# EAGLE design Stalker v2.3 (EAGLE 6.1)
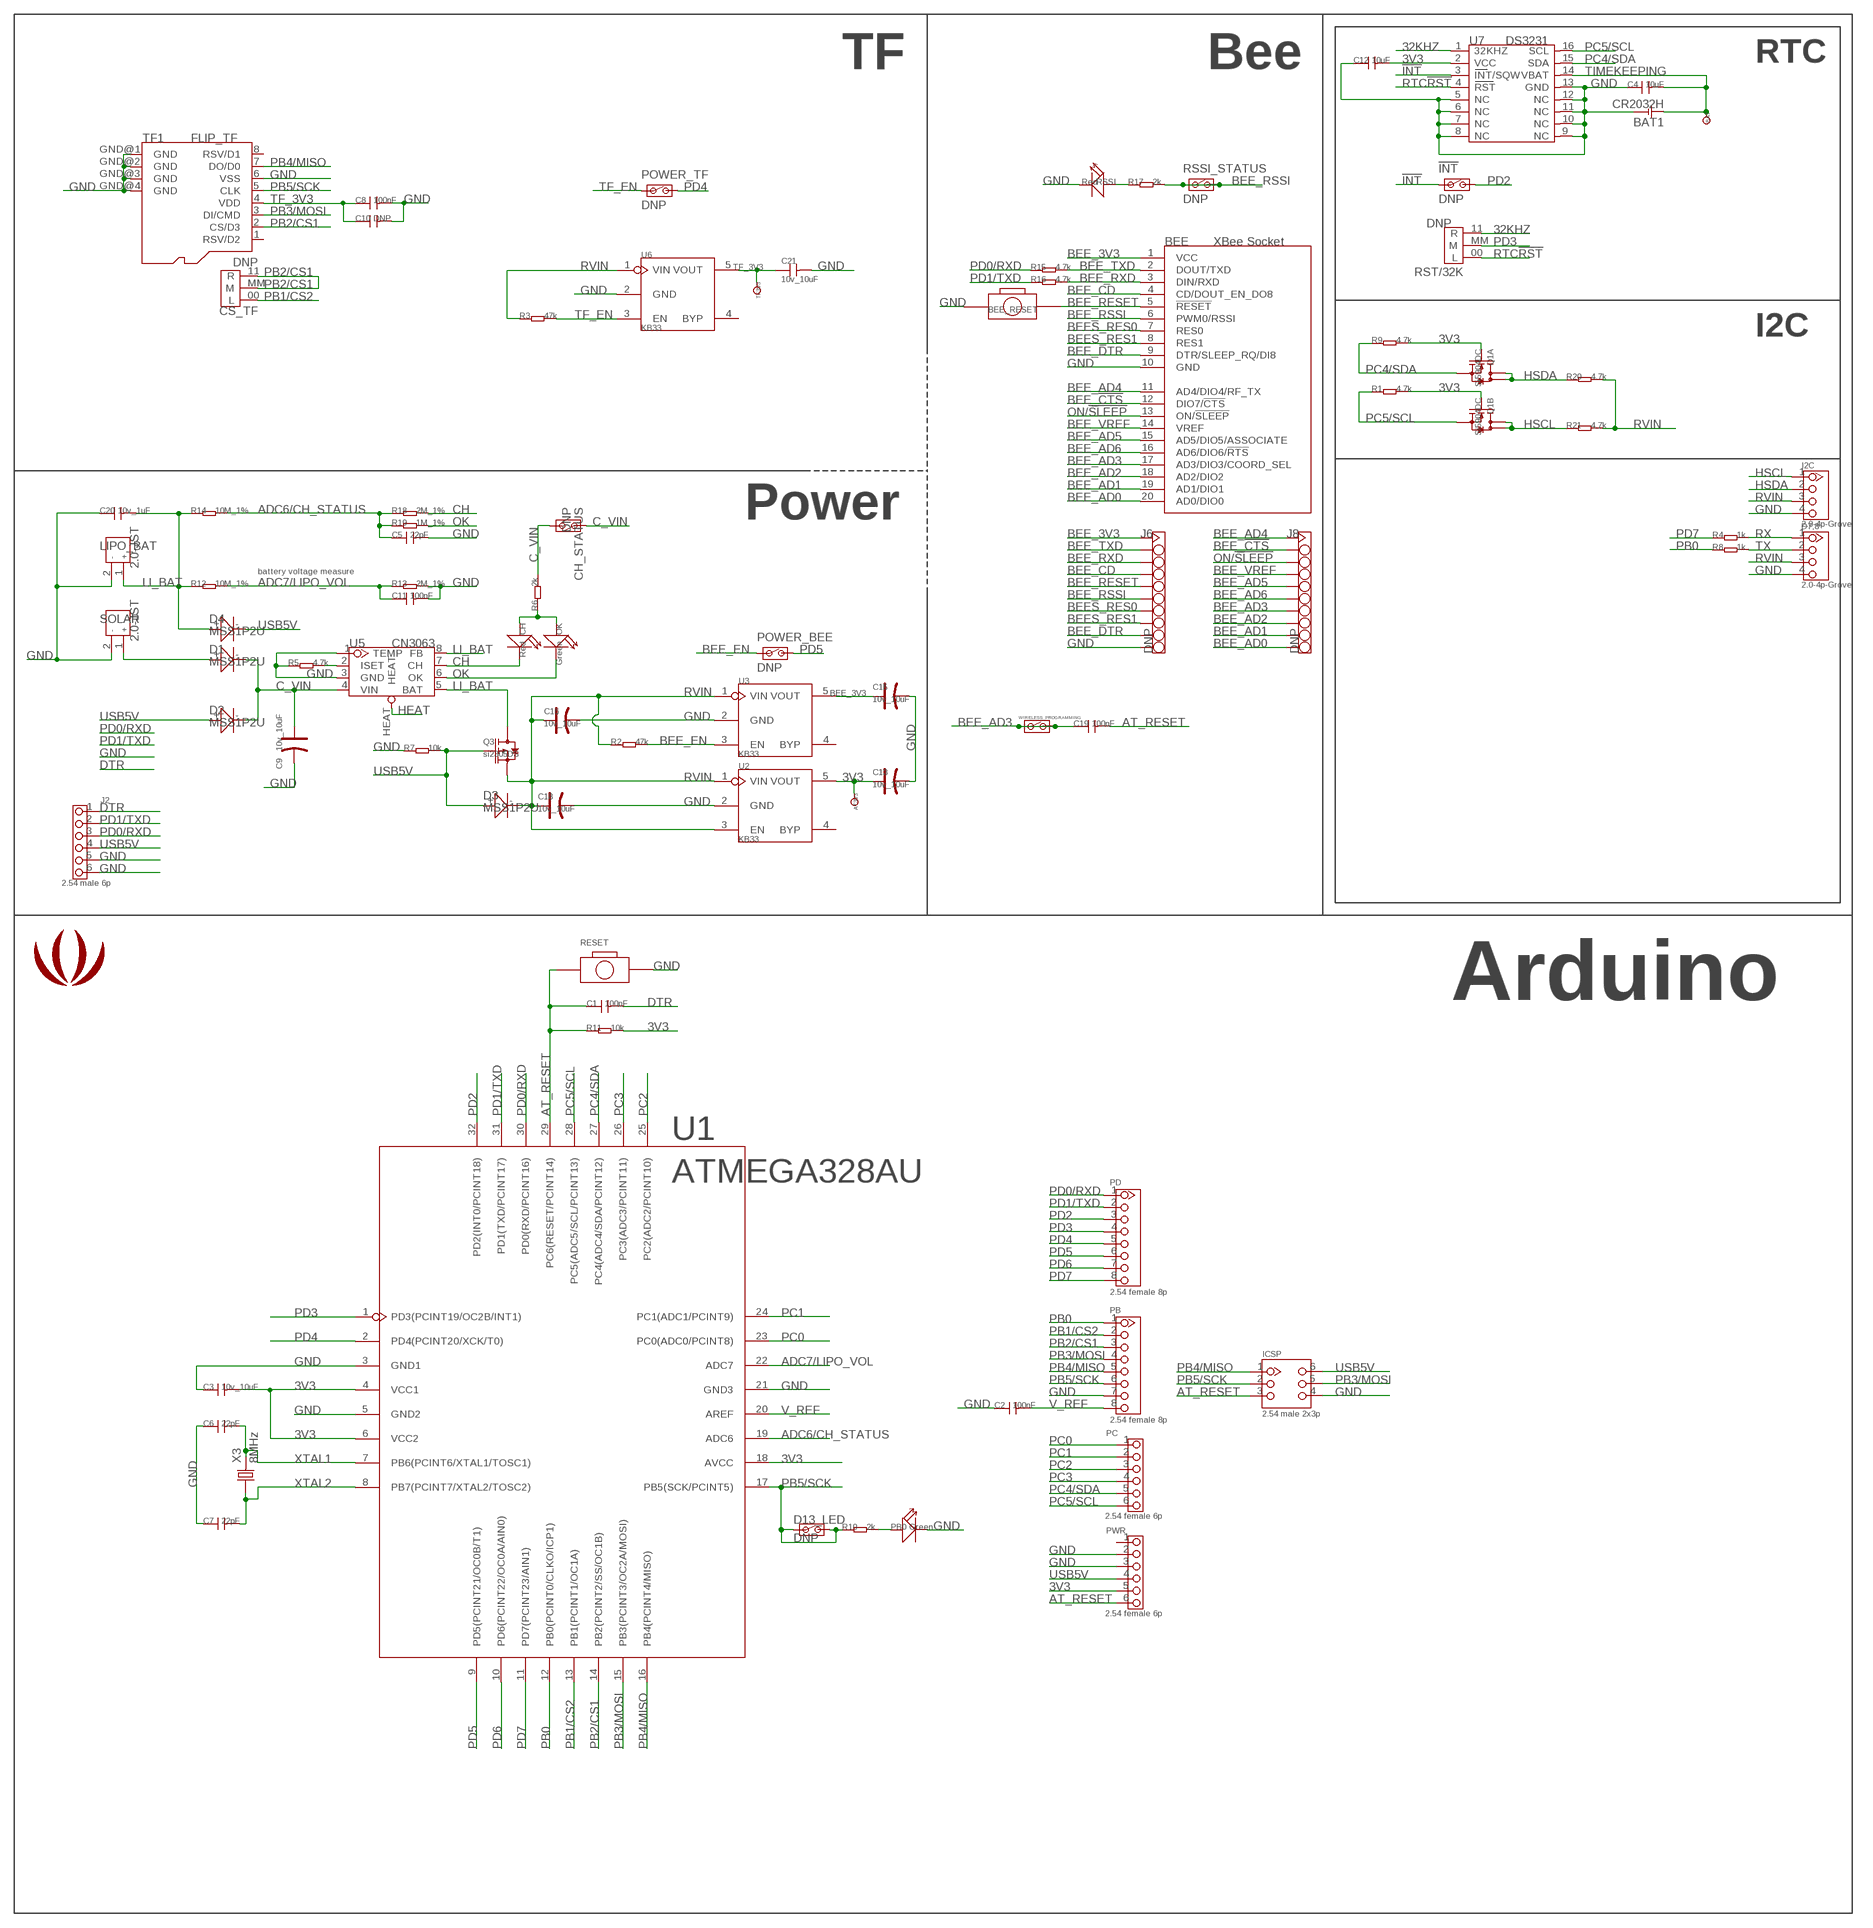
[diagram p0: schematic, sheet 1]

## Parts
!INT  DNP  JP_SW  [JP_SW]
AT3V3  DNP  TEST_POINT_SIZE_3030  [TP_3535]
BAT  DNP  TEST_POINT_SIZE_3030  [TP_3535]
BAT1  CR2032H  [CR2032H]
BEE  XBee Socket  BEEO  [BEE]
BEE_RESET  3.8x6.1 button  BOTTON_1_SMD  [BOTTON_1]
C1  100nF  C-0603  [0603]
C2  100nF  C-0603  [0603]
C3  10v_10uF  C-0805  [0805]
C4  10uF  C-0805  [0805]
C5  22pF  C-0603  [0603]
C6  22pF  C-0603  [0603]
C7  22pF  C-0603  [0603]
C8  100nF  C-0603  [0603]
C9  10v_10uF  CAP-AVX-A  [AVX-A]
C10  DNP  C-0603  [0603]
C11  100nF  C-0603  [0603]
C12  10uF  C-0805  [0805]
C13  10v_10uF  CAP-AVX-A  [AVX-A]
C15  10v_10uF  CAP-AVX-A  [AVX-A]
C16  10v_10uF  CAP-AVX-A  [AVX-A]
C18  10v_10uF  CAP-AVX-A  [AVX-A]
C19  100nF  C-0603  [0603]
C20  10v_1uF  C-0805  [0805]
C21  10v_10uF  C-0805  [0805]
CH  Red  007-LED0603  [D0603]
CH_STATUS  DNP  JP_SW  [JP_SW]
CS_TF  DNP  JUMPER  [JUMPER]
D1  MSS1P2U  010-DMSS1P2U  [D1005]
D2  MSS1P2U  010-DMSS1P2U  [D1005]
D3  MSS1P2U  010-DMSS1P2U  [D1005]
D4  MSS1P2U  010-DMSS1P2U  [D1005]
D7,8  2.0-4p-Grove  TWIG-4P-2.0-2.0  [4P-2.0]
D13_LED  DNP  JP_SW  [JP_SW]
I2C  2.0-4p-Grove  TWIG-4P-2.0-2.0  [4P-2.0]
ICSP  2.54 male 2x3p  HEADER-2X3P-2.54  [2X3P-2.54-LEADED]
J2  2.54 male 6p  HEADER-6P-LEADED-2.54  [6P-2.54-LEADED]
J6  DNP  HEADER_1X10DD  [HEADER_1X10]
J8  DNP  HEADER_1X10DD  [HEADER_1X10]
LIPO_BAT  2.0-JST  JACK-JST-2P-PW'2.0'  [JST-2.0]
LOGO1  LOGO  [LOGO_RO]
OK  Green  007-LED0603  [D0603]
PB  2.54 female 8p  HEADER-8P-2.54-LEADED  [8P-2.54-LEADED]
PB0  Green  007-LED0603  [D0603]
PC  2.54 female 6p  HEADER-6P-LEADED-2.54  [6P-2.54-LEADED]
PD  2.54 female 8p  HEADER-8P-2.54-LEADED  [8P-2.54-LEADED]
POWER_BEE  DNP  JP_SW  [JP_SW]
POWER_TF  DNP  JP_SW  [JP_SW]
PWR  2.54 female 6p  HEADER-6P-LEADED-2.54  [6P-2.54-LEADED]
Q1  Si5904DC  010-DUAL-N-MOSFET_1206-8  [1206-8]
Q3  si2305DS  010-P-MOSFETSOT23  [SOT23]
R1  4.7k  005-R0603  [0603@1]
R2  47k  005-R0603  [0603@1]
R3  47k  005-R0603  [0603@1]
R4  1k  005-R0603  [0603@1]
R5  4.7k  005-R0603  [0603@1]
R6  2k  005-R0603  [0603@1]
R7  10k  005-R0603  [0603@1]
R8  1k  005-R0603  [0603@1]
R9  4.7k  005-R0603  [0603@1]
R10  2k  005-R0603  [0603@1]
R11  10k  005-R0603  [0603@1]
R12  10M_1%  005-R0603  [0603@1]
R13  2M_1%  005-R0603  [0603@1]
R14  10M_1%  005-R0603  [0603@1]
R15  4.7k  005-R0603  [0603@1]
R16  4.7k  005-R0603  [0603@1]
R17  2k  005-R0603  [0603@1]
R18  2M_1%  005-R0603  [0603@1]
R19  1M_1%  005-R0603  [0603@1]
R20  4.7k  005-R0603  [0603@1]
R21  4.7k  005-R0603  [0603@1]
RESET  3.8x6.1 button  BOTTON_1_SMD  [BOTTON_1]
RSSI  Red  007-LED0603  [D0603]
RSSI_STATUS  DNP  JP_SW  [JP_SW]
RST/32K  DNP  JUMPER  [JUMPER]
SOLAR  2.0-JST  JACK-JST-2P-PW'2.0'  [JST-2.0]
TF1  FLIP_TF  [FLIP_TF]
TF3V3  DNP  TEST_POINT_SIZE_3030  [TP_3535]
U1  ATMEGA328AU  ATMEGA168-20AU  [ATMEGA168-20AU]
U2  KB33  MIC5025_X.X  [SOT23-5]
U3  KB33  MIC5025_X.X  [SOT23-5]
U5  CN3063  CN3083  [SOP8]
U6  KB33  MIC5025_X.X  [SOT23-5]
U7  DS3231  [SO16-W]
WIRELESS_PROGRAMMING  DNP  JP_SW  [JP_SW]
X3  8MHz  011-CRYSTALHC49S  [HC49/S]

## Nets
3V3: AT3V3.T C3.2 C12.2 C13.+ PWR.5 Q1.2(A:G) Q1.4(B:G) R1.2 R9.2 R11.2 U1.4(VCC1) U1.6(VCC2) U1.18(AVCC) U2.5(VOUT) U7.2(VCC)
32KHZ: RST/32K.11(R) U7.1(32KHZ)
!INT: !INT.1 U7.3(INT/SQW)
ADC6/CH_STATUS: C5.1 R14.2 R18.1 R19.1 U1.19(ADC6)
ADC7/LIPO_VOL: C11.1 R12.2 R13.1 U1.22(ADC7)
AT_RESET: C1.1 C19.2 ICSP.3 PWR.6 R11.1 RESET.1 U1.29(PC6(RESET/PCINT14))
BEE_3V3: BEE.1(VCC) C15.+ J6.1 U3.5(VOUT)
BEE_!CTS: BEE.12(DIO7/!CTS) J8.2
BEE_AD0: BEE.20(AD0/DIO0) J8.10
BEE_AD1: BEE.19(AD1/DIO1) J8.9
BEE_AD2: BEE.18(AD2/DIO2) J8.8
BEE_AD3: BEE.17(AD3/DIO3/COORD_SEL) C19.1 J8.7 WIRELESS_PROGRAMMING.1 WIRELESS_PROGRAMMING.2
BEE_AD4: BEE.11(AD4/DIO4/RF_TX) J8.1
BEE_AD5: BEE.15(AD5/DIO5/ASSOCIATE) J8.5
BEE_AD6: BEE.16(AD6/DIO6/!RTS) J8.6
BEE_CD: BEE.4(CD/DOUT_EN_DO8) J6.4
BEE_DTR: BEE.9(DTR/SLEEP_RQ/DI8) J6.9
BEE_EN: POWER_BEE.1 R2.2 U3.3(EN)
BEE_RESET: BEE.5(!RESET) BEE_RESET.P$2 J6.5
BEE_RSSI: BEE.6(PWM0/RSSI) J6.6 R17.2 RSSI_STATUS.1 RSSI_STATUS.2
BEE_RXD: BEE.3(DIN/RXD) J6.3 R16.2
BEE_TXD: BEE.2(DOUT/TXD) J6.2 R15.2
BEE_VREF: BEE.14(VREF) J8.4
BEES_RES0: BEE.7(RES0) J6.7
BEES_RES1: BEE.8(RES1) J6.8
C_VIN: C9.+ CH_STATUS.1 CH_STATUS.2 D1.- D2.- R6.2 U5.4(VIN)
CH: CH.- R18.2 U5.7(CH)
DTR: C1.2 J2.1
GND: BAT1.- BEE.10(GND) BEE_RESET.1 C2.1 C3.1 C4.1 C5.2 C6.1 C7.1 C8.2 C9.- C10.2 C11.2 C12.1 C13.- C15.- C16.- C18.- C20.1 C21.2 D7,8.4 I2C.4 ICSP.4 J2.5 J2.6 J6.10 LIPO_BAT.2 PB0.- PB.7 PWR.2 PWR.3 R5.1 R7.1 R13.2 RESET.P$2 RSSI.- SOLAR.2 TF1.6(VSS) TF1.GND@1(GND) TF1.GND@2(GND) TF1.GND@3(GND) TF1.GND@4(GND) U1.3(GND1) U1.5(GND2) U1.21(GND3) U2.2(GND) U3.2(GND) U5.1(TEMP) U5.3(GND) U6.2(GND) U7.5(NC) U7.6(NC) U7.7(NC) U7.8(NC) U7.9(NC) U7.10(NC) U7.11(NC) U7.12(NC) U7.13(GND)
HEAT: U5.HEAT
HSCL: I2C.1 Q1.5(B:D) Q1.6(B:D) R21.1
HSDA: I2C.2 Q1.7(A:D) Q1.8(A:D) R20.1
LI_BAT: C20.2 D4.+ LIPO_BAT.1 Q3.3(D) R12.1 R14.1 U5.5(BAT) U5.8(FB)
N$1: PB0.+ R10.2
N$3: D1.+ SOLAR.1
N$5: R5.2 U5.2(ISET)
N$6: R17.1 RSSI.+
N$8: CH.+ OK.+ R6.1
OK: OK.- R19.2 U5.6(OK)
ON/!SLEEP: BEE.13(ON/!SLEEP) J8.3
PB0: PB.1 R8.1 U1.12(PB0(PCINT0/CLKO/ICP1))
PB1/CS2: CS_TF.00(L) PB.2 U1.13(PB1(PCINT1/OC1A))
PB2/CS1: CS_TF.11(R) CS_TF.MM(M) PB.3 TF1.2(CS/D3) U1.14(PB2(PCINT2/SS/OC1B))
PB3/MOSI: ICSP.5 PB.4 TF1.3(DI/CMD) U1.15(PB3(PCINT3/OC2A/MOSI))
PB4/MISO: ICSP.1 PB.5 TF1.7(DO/D0) U1.16(PB4(PCINT4/MISO))
PB5/SCK: D13_LED.1 D13_LED.2 ICSP.2 PB.6 R10.1 TF1.5(CLK) U1.17(PB5(SCK/PCINT5))
PC0: PC.1 U1.23(PC0(ADC0/PCINT8))
PC1: PC.2 U1.24(PC1(ADC1/PCINT9))
PC2: PC.3 U1.25(PC2(ADC2/PCINT10))
PC3: PC.4 U1.26(PC3(ADC3/PCINT11))
PC4/SDA: PC.5 Q1.1(A:S) R9.1 U1.27(PC4(ADC4/SDA/PCINT12)) U7.15(SDA)
PC5/SCL: PC.6 Q1.3(B:S) R1.1 U1.28(PC5(ADC5/SCL/PCINT13)) U7.16(SCL)
PD0/RXD: J2.3 PD.1 R15.1 U1.30(PD0(RXD/PCINT16))
PD1/TXD: J2.2 PD.2 R16.1 U1.31(PD1(TXD/PCINT17))
PD2: !INT.2 PD.3 U1.32(PD2(INT0/PCINT18))
PD3: PD.4 RST/32K.MM(M) U1.1(PD3(PCINT19/OC2B/INT1))
PD4: PD.5 POWER_TF.2 U1.2(PD4(PCINT20/XCK/T0))
PD5: PD.6 POWER_BEE.2 U1.9(PD5(PCINT21/OC0B/T1))
PD6: PD.7 U1.10(PD6(PCINT22/OC0A/AIN0))
PD7: PD.8 R4.1 U1.11(PD7(PCINT23/AIN1))
RTC!RST: RST/32K.00(L) U7.4(RST)
RVIN: C16.+ C18.+ D3.- D7,8.3 I2C.3 Q3.2(S) R2.1 R3.1 R20.2 R21.2 U2.1(VIN) U2.3(EN) U3.1(VIN) U6.1(VIN)
RX: D7,8.1 R4.2
TF_3V3: C8.1 C10.1 C21.1 TF1.4(VDD) TF3V3.T U6.5(VOUT)
TF_EN: POWER_TF.1 R3.2 U6.3(EN)
TIMEKEEPING: BAT1.+ BAT.T C4.2 U7.14(VBAT)
TX: D7,8.2 R8.2
USB5V: D2.+ D3.+ D4.- ICSP.6 J2.4 PWR.4 Q3.1(G) R7.2
V_REF: C2.2 PB.8 U1.20(AREF)
XTAL1: C6.2 U1.7(PB6(PCINT6/XTAL1/TOSC1)) X3.2
XTAL2: C7.2 U1.8(PB7(PCINT7/XTAL2/TOSC2)) X3.1
Unconnected: PWR.1 TF1.1(RSV/D2) TF1.8(RSV/D1) U2.4(BYP) U3.4(BYP) U6.4(BYP)

## Notes on the sheet
- TF | Bee | RTC
- I2C
- Power
- battery voltage measure
- Arduino

## Library data of the parts
!INT CH_STATUS D13_LED POWER_BEE POWER_TF RSSI_STATUS WIRELESS_PROGRAMMING = CPT_SMD:JP_SW
AT3V3 BAT TF3V3 = For_Test_Albert:TEST_POINT
BAT1 = BAT:CR2032H
BEE = EXT_moudle:BEE
BEE_RESET RESET = CPT_SMD:BOTTON_1
C1-C8 C10-C12 C19-C21 = Discrete:C*: Ceramic Capacitors
C9 C13 C15 C16 C18 = Discrete:CAP*: Electrolytic Capacitors,Tantalum Capacitors and Super Capacitors
CH OK PB0 RSSI = Discrete:007-LED*
CS_TF RST/32K = CPT_SMD:JUMPER
D1-D4 = Discrete:010-D*
D7,8 I2C = Connector:TWIG-4P-2.0
ICSP = Connector:HEADER-2X3P
J2 PC PWR = Connector:HEADER-6P
J6 J8 = CONNECTER:HEADER_1X10
LIPO_BAT SOLAR = Connector:JACK-JST-2P-PW
LOGO1 = logo:LOGO
PB PD = Connector:HEADER-8P
Q1 = Discrete:010-DUAL-N-MOSFET*: Si5902BDC Si5904DC Si5908DC Si5920DC
Q3 = Discrete:010-P-MOSFET*: Si2305DS Si2323CDS
R1-R21 = Discrete:005-R*
TF1 = Holders:FLIP_TF: http://garden.seeedstudio.com/images/e/e4/Flip_TF_Holder.jpg
U1 = IC_SMD:ATMEGA168-20AU
U2 U3 U6 = ICs_v54:MIC5025_X.X
U5 = ICs_v54:CN3083
U7 = IC:DS3231: Extremely Accurate I2C-Integrated RTC/TCXO/Crystal http://pdfserv.maxim-ic.com/en/ds/DS3231.pdf
X3 = Discrete:011-CRYSTAL*: CRYSTAL

## Net classes
0 default: width 0.152 mm, drill 0.305 mm, clearance 0.152 mm

## Board
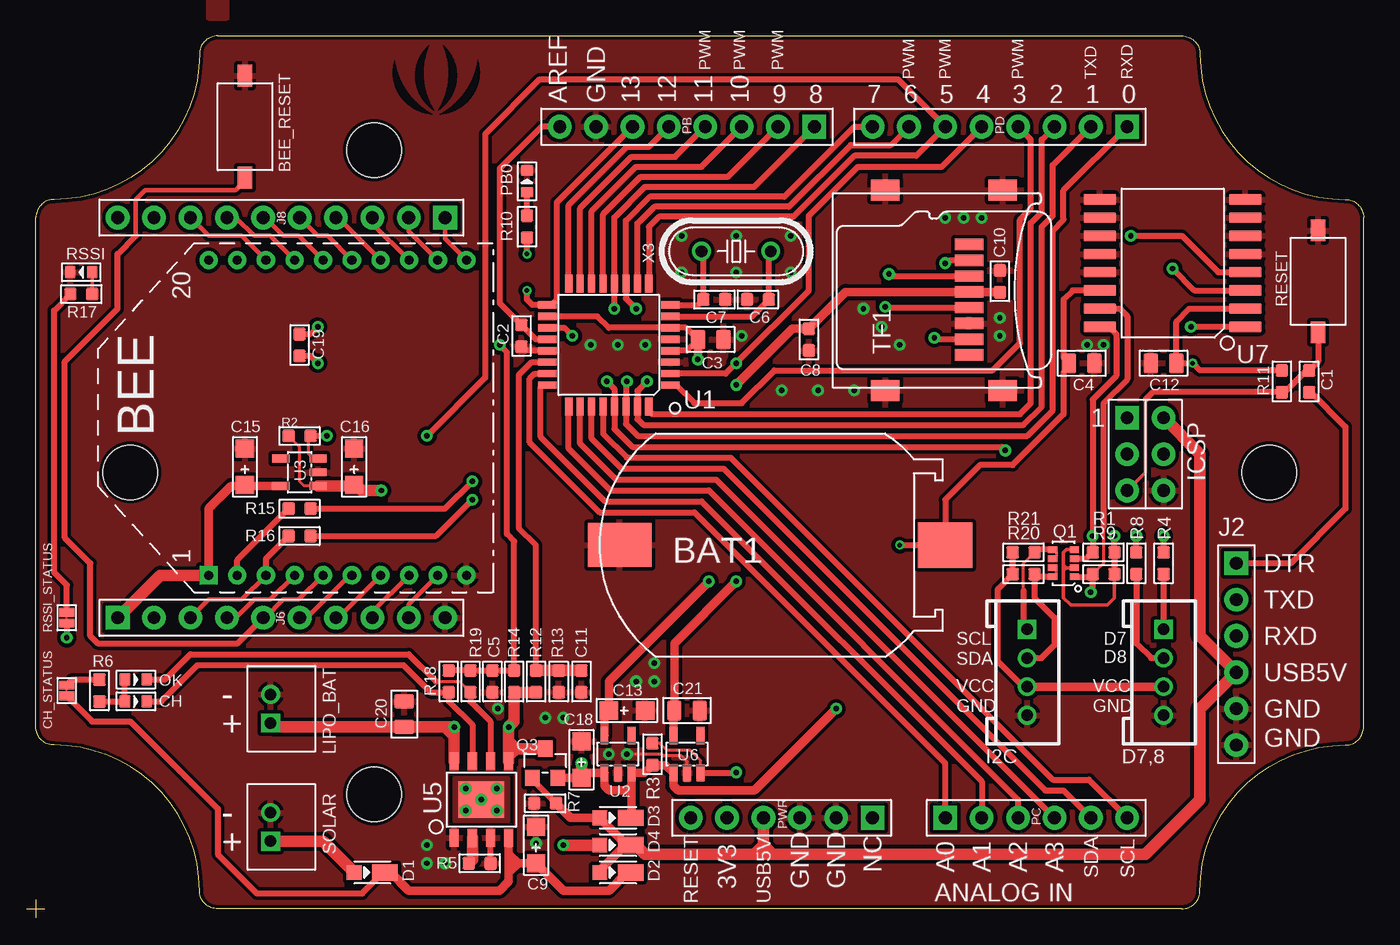
[diagram p1: board, top side]
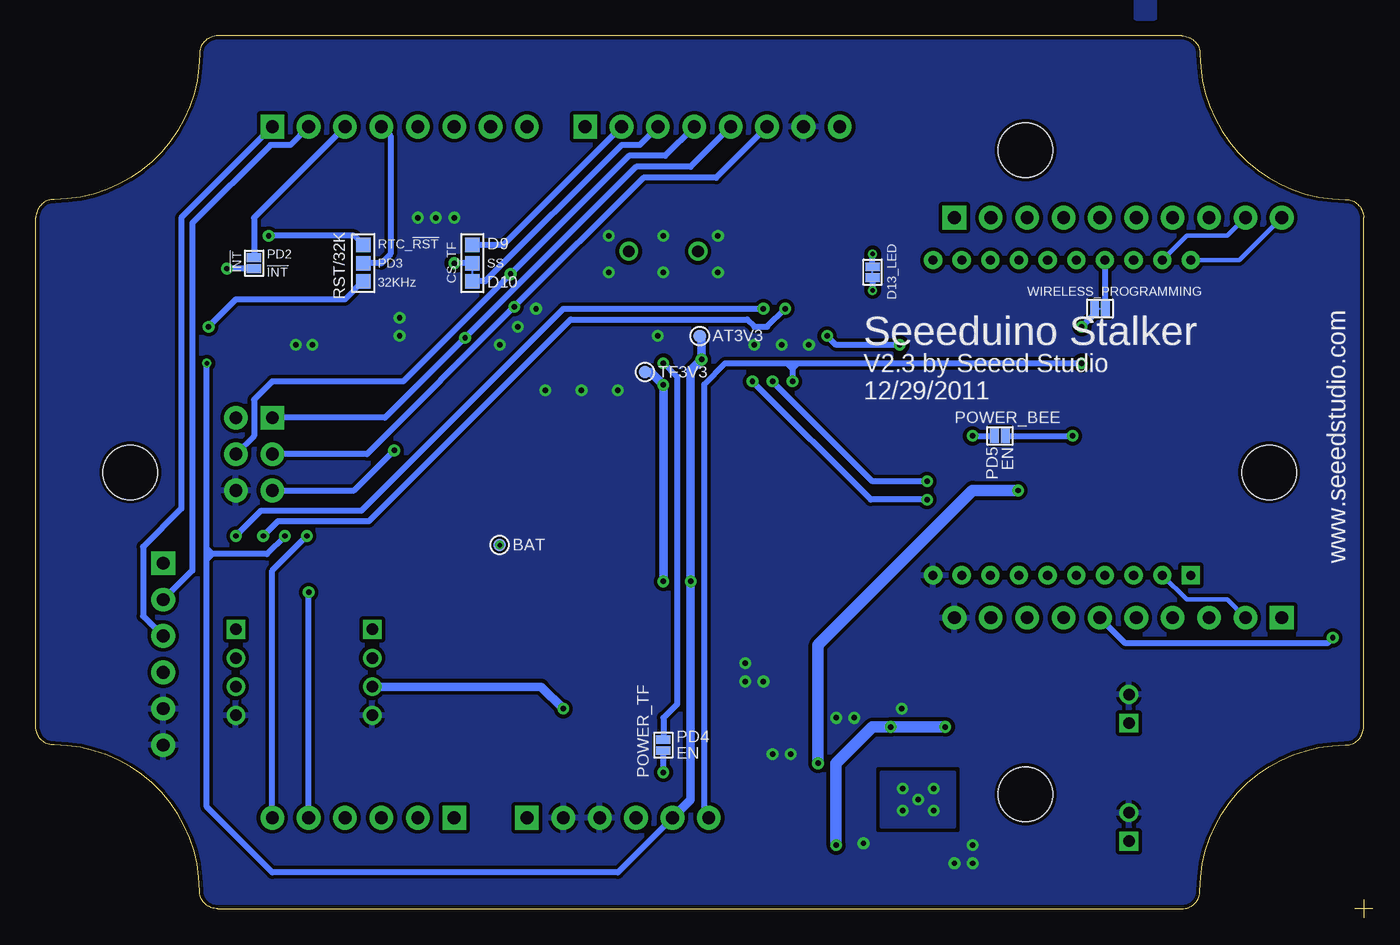
[diagram p2: board, bottom side, seen from below]

Size 92.71 x 60.96 mm. Coordinates in mm from the lower left corner, seen from the top.
Outline: 12.7,60.96 arc90 11.43,59.69 arc-90 1.27,49.53 arc90 0,48.26 0,12.7 arc90 1.27,11.43 arc-90 11.43,1.27 arc90 12.7,0 80.01,0 arc90 81.28,1.27 arc-90 91.44,11.43 arc90 92.71,12.7 92.71,48.26 arc90 91.44,49.53 arc-90 81.28,59.69 arc90 80.01,60.96 12.7,60.96
Copper layers (1*16): Top 0.035mm / dielectric 1.5mm / Bottom 0.035mm
Design rules: minimum track width 6mil, minimum drill 12mil, track to track 6mil, track to pad 6mil, pad to pad 6mil, via to via 6mil, smd to smd 0mil, copper to edge 10mil, drill to drill 10mil, minimum pad ring 10mil, minimum via ring 6mil, stop-mask expansion 2mil, vias tented up to drill 25mil, thermal gap 10mil
Holes 3.81 mm at 23.61,52.98 86.11,30.48 6.61,30.48 23.61,7.98
tRestrict: area 73.7,43.2 to 74.9,48.9; area 83.8,43.2 to 85.1,48.9
Milling: 2 lines

### Footprints (pad centres in the part's own frame; a part is rotated, then mirrored left to right if it is on the bottom)
JP_SW = smd 1.016 x 0.61: 1 0,0.381; 2 0,-0.381
TP_3535 = smd 0.889 x 0.889: T 0,0
CR2032H = smd 3.81 x 3.175: + 12.7,0 | smd 4.445 x 3.048: - -10.033,0
BEE = drill 0.635 pad 1.27 square: 1 -11,0 | drill 0.635 pad 1.27: 2 -11,-2; 3 -11,-4; 4 -11,-6; 5 -11,-8; 6 -11,-10; 7 -11,-12; 8 -11,-14; 9 -11,-16; 10 -11,-18; 11 11,-18; 12 11,-16; 13 11,-14; 14 11,-12; 15 11,-10; 16 11,-8; 17 11,-6; 18 11,-4; 19 11,-2; 20 11,0
BOTTON_1 = smd 1.524 x 1.016: 1 -3.556,0; P$2 3.556,0
0603 = smd 0.889 x 0.889: 1 -0.762,0; 2 0.762,0
0805 = smd 1.016 x 1.397: 1 -0.889,0; 2 0.889,0
AVX-A = smd 1.27 x 1.27: + -1.27,0; - 1.27,0
D0603 = smd 0.762 x 0.889: + -0.762,0; - 0.762,0
JUMPER = smd 1.016 x 1.016: 00 -1.27,0; 11 1.27,0; MM 0,0
D1005 = smd 1.016 x 1.016: + 1.27,0 | smd 1.778 x 1.143: - -0.889,0
4P-2.0 = drill 0.8 pad 1.27 square: 1 -3,0 | drill 0.8 pad 1.27: 2 -1,0; 3 1,0; 4 3,0
2X3P-2.54-LEADED = drill 0.889 pad 1.651 square: 1 -1.27,2.54 | drill 0.889 pad 1.651: 2 -1.27,0; 3 -1.27,-2.54; 4 1.27,-2.54; 5 1.27,0; 6 1.27,2.54
6P-2.54-LEADED = drill 0.889 pad 1.651 square: 1 0,6.35 | drill 0.889 pad 1.651: 2 0,3.81; 3 0,1.27; 4 0,-1.27; 5 0,-3.81; 6 0,-6.35
HEADER_1X10 = drill 0.889 pad 1.651 square: 1 0,11.43 | drill 0.889 pad 1.651: 2 0,8.89; 3 0,6.35; 4 0,3.81; 5 0,1.27; 6 0,-1.27; 7 0,-3.81; 8 0,-6.35; 9 0,-8.89; 10 0,-11.43
JST-2.0 = drill 0.8 pad 1.3 square: 1 -1,0.75 | drill 0.8 pad 1.3: 2 1,0.75
8P-2.54-LEADED = drill 0.889 pad 1.651 square: 1 0,8.89 | drill 0.889 pad 1.651: 2 0,6.35; 3 0,3.81; 4 0,1.27; 5 0,-1.27; 6 0,-3.81; 7 0,-6.35; 8 0,-8.89
1206-8 = smd 0.457 x 0.635: 1 -0.953,-0.762; 2 -0.318,-0.762; 3 0.318,-0.762; 4 0.953,-0.762; 5 0.953,0.762; 6 0.318,0.762; 7 -0.318,0.762; 8 -0.953,0.762
SOT23@1 = smd 1.016 x 1.143: 1 -0.889,-1.016; 2 0.889,-1.016; 3 0,1.016
0603@1 = smd 0.889 x 0.889: 1 -0.762,0; 2 0.762,0
FLIP_TF = smd 0.8 x 2: 1 3.2,0.25; 2 2.1,0.25; 3 1,0.25; 4 -0.1,0.25; 5 -1.2,0.25; 6 -2.3,0.25; 7 -3.4,0.25; 8 -4.5,0.25 | smd 1.45 x 2: GND@1 -7,6.1; GND@2 -7,-2.1; GND@3 7,-2.1; GND@4 7,6.1
ATMEGA168-20AU = smd 1.27 x 0.508: 1 -4.293,2.8; 2 -4.293,2; 3 -4.293,1.2; 4 -4.293,0.4; 5 -4.293,-0.4; 6 -4.293,-1.2; 7 -4.293,-2; 8 -4.293,-2.8; 17 4.293,-2.8; 18 4.293,-2; 19 4.293,-1.2; 20 4.293,-0.4; 21 4.293,0.4; 22 4.293,1.2; 23 4.293,2; 24 4.293,2.8 | smd 0.508 x 1.27: 9 -2.8,-4.293; 10 -2,-4.293; 11 -1.2,-4.293; 12 -0.4,-4.293; 13 0.4,-4.293; 14 1.2,-4.293; 15 2,-4.293; 16 2.8,-4.293; 25 2.8,4.293; 26 2,4.293; 27 1.2,4.293; 28 0.4,4.293; 29 -0.4,4.293; 30 -1.2,4.293; 31 -2,4.293; 32 -2.8,4.293
SOT23-5 = smd 0.55 x 1.2: 1 -0.95,-1.3; 2 0,-1.3; 3 0.95,-1.3; 4 0.95,1.3; 5 -0.95,1.3
SOP8 = smd 0.635 x 1.27: 1 -1.905,-2.667; 2 -0.635,-2.667; 3 0.635,-2.667; 4 1.905,-2.667; 5 1.905,2.667; 6 0.635,2.667; 7 -0.635,2.667; 8 -1.905,2.667 | smd 3.175 x 2.54: HEAT 0,0
SO16-W = smd 0.762 x 2.286: 1 -4.445,-5.08; 2 -3.175,-5.08; 3 -1.905,-5.08; 4 -0.635,-5.08; 5 0.635,-5.08; 6 1.905,-5.08; 7 3.175,-5.08; 8 4.445,-5.08; 9 4.445,5.08; 10 3.175,5.08; 11 1.905,5.08; 12 0.635,5.08; 13 -0.635,5.08; 14 -1.905,5.08; 15 -3.175,5.08; 16 -4.445,5.08
HC49/S = drill 0.813: 1 -2.413,0; 2 2.413,0

### Placement (x,y rotation side)
!INT  77.47,45.09 180 bottom
AT3V3  46.35,40.01 0 bottom
BAT  60.33,25.4 0 bottom
BAT1  50.8,25.4 0 top
BEE  12.06,34.29 90 top
BEE_RESET  14.61,54.61 270 top
C1  88.9,36.83 270 top
C2  33.91,40.01 90 top
C3  47.12,39.75 180 top
C4  73.03,38.1 180 top
C5  31.88,15.88 270 top
C6  50.42,42.55 0 top
C7  47.37,42.55 180 top
C8  53.98,39.75 270 top
C9  34.92,4.45 90 top
C10  67.31,43.81 90 top
C11  38.1,15.88 270 top
C12  78.74,38.1 0 top
C13  41.27,13.84 0 top
C15  14.61,30.86 90 top
C16  22.23,30.86 90 top
C18  38.1,10.41 90 top
C19  18.41,39.37 270 top
C20  25.72,13.59 270 top
C21  45.47,13.84 0 top
CH  6.99,14.48 0 top
CH_STATUS  2.16,15.24 180 top
CS_TF  62.23,45.09 270 bottom
D1  23.5,2.54 180 top
D2  40.64,2.54 180 top
D3  40.64,6.35 180 top
D4  40.64,4.45 180 top
D7,8  78.74,16.51 270 top
D13_LED  34.29,44.45 180 bottom
I2C  69.22,16.51 270 top
ICSP  77.47,31.75 0 top
J2  83.82,17.78 0 top
J6  17.14,20.32 90 top
J8  17.14,48.26 270 top
LIPO_BAT  17.14,13.97 90 top
LOGO1  27.94,57.15 0 top
OK  6.99,16 0 top
PB  45.47,54.61 270 top
PB0  34.29,50.8 90 top
PC  69.85,6.35 90 top
PD  67.31,54.61 270 top
POWER_BEE  25.4,33.02 270 bottom
POWER_TF  48.9,11.43 180 bottom
PWR  52.07,6.35 270 top
Q1  71.75,24.13 90 top
Q3  si2305DS  [SOT23@1]  35.56,10.16 0 top
R1  74.55,24.89 0 top
R2  18.41,33.02 0 top
R3  43.05,10.79 90 top
R4  78.74,24.13 270 top
R5  30.99,3.17 180 top
R6  4.45,15.24 90 top
R7  35.56,7.37 0 top
R8  76.83,24.13 270 top
R9  74.55,23.37 0 top
R10  34.29,47.62 90 top
R11  87,36.83 90 top
R12  34.92,15.88 90 top
R13  36.51,15.88 270 top
R14  33.4,15.88 90 top
R15  18.41,27.94 180 top
R16  18.41,26.04 180 top
R17  3.17,42.93 180 top
R18  28.83,15.88 270 top
R19  30.35,15.88 270 top
R20  68.96,23.37 180 top
R21  68.96,24.89 180 top
RESET  89.53,43.81 90 top
RSSI  3.17,44.45 180 top
RSSI_STATUS  2.16,20.32 0 top
RST/32K  69.85,45.09 270 bottom
SOLAR  17.14,5.71 90 top
TF1  65.41,43.18 90 top
TF3V3  50.16,37.47 0 bottom
U1  40.01,39.37 180 top
U2  40.64,10.79 0 top
U3  18.41,30.48 90 top
U5  31.11,7.62 0 top
U6  45.47,10.79 0 top
U7  79.38,45.09 90 top
WIRELESS_PROGRAMMING  18.41,41.91 270 bottom
X3  48.9,45.91 0 top

### Tracks (layer width: path | path; a pad name or v marks a point on that pad's centre or on a via)
3V3  (via drill 0.3 pad 0.64, 0.38 pad 0.81)
  Top 0.254: Q1.4 71.94,25.08 71.75,24.89 71.75,24 | Q1.2 71.94,23.81 | 71.94,23.81 71.75,24 | R9.2 75.31,21.72 74.8,21.21 72.26,21.21 71.75,21.72 71.75,23.62 | 71.75,23.62 71.75,24 | 71.94,23.81 71.75,23.62
  Top 0.406: U1.4 45.45,38.97 C3.2 45.41,40.57 U1.6 40.01,40.57 39.21,41.37 U1.18 | R11.2 81.28,37.59 v80.77,38.1 C12.2 79.63,41.02 80.52,41.91 U7.2 | R9.2 R1.2 v75.31,26.04
  Top 0.61: v46.23,38.35 C3.2 | U2.5 39.69,13.53 C13.+ 40.01,15.88 v46.99,22.86
  Bottom 0.406: PWR.5 52.07,2.54 76.2,2.54 80.77,7.11 80.77,24.38 | 80.77,24.38 80.77,25.15 | 80.77,25.15 v80.77,38.1 | v75.31,26.04 76.58,24.77 80.39,24.77 | 80.39,24.77 80.77,25.15 | 80.77,24.38 80.39,24.77
  Bottom 0.61: PWR.5 46.99,7.62 v46.99,22.86 46.99,37.59 v46.23,38.35 46.23,39.88 AT3V3.T
  pour Bottom: 14.61,63.5 15.88,63.5 15.88,62.23 14.61,62.23
32KHZ  (via drill 0.38 pad 0.81)
  Top 0.406: v80.64,40.64 U7.1
  Bottom 0.406: RST/32K.11 71.12,42.55 78.74,42.55 v80.64,40.64
!INT  (via drill 0.38 pad 0.81)
  Top 0.406: U7.3 80.9,43.18 v79.38,44.7
  Bottom 0.406: !INT.1 v79.38,44.7
ADC6/CH_STATUS  (via drill 0.38 pad 0.81)
  Top 0.406: R18.1 R19.1 C5.1 R14.2 33.4,25.65 32.89,26.16 32.89,38.86 v32.38,39.37 | U1.19 36.9,40.57 v37.47,40.01
  Bottom 0.406: v32.38,39.37 36.83,39.37 v37.47,40.01
ADC7/LIPO_VOL
  Top 0.406: U1.22 34.61,38.17 33.72,37.27 33.72,26.61 34.92,25.4 R12.2
  Top 0.813: R12.2 R13.1 C11.1
AT_RESET  (via drill 0.38 pad 0.81)
  Top 0.254: 77.47,35.56 77.47,30.48 ICSP.3
  Top 0.406: v39.88,36.83 40.41,36.3 U1.29 40.41,33.51 41.66,32.26 67.44,32.26 v67.69,32 | C19.2 19.18,38.61 v19.68,38.1 | 77.47,35.56 77.98,36.07 R11.1 87.19,36.07 88.71,37.59 C1.1 89.53,38.23 RESET.1
  Bottom 0.406: PWR.6 46.04,6.67 46.04,36.64 44.58,38.1 40.26,38.1 | 40.26,38.1 39.5,38.1 | 39.88,37.72 v39.88,36.83 | 39.5,38.1 39.88,37.72 | 40.26,38.1 39.88,37.72 | 39.5,38.1 v19.68,38.1 | ICSP.3 70.48,29.21 v67.69,32
BEE_3V3
  Top 0.61: U3.5 14.61,29.53 | 14.61,29.53 13.65,29.53 12.06,27.94 BEE.1 | C15.+ 14.61,29.53
  Top 0.813: BEE.1 8.69,23.29 J6.1
BEE_!CTS
  Top 0.305: BEE.12 26.04,47.32 J8.2
BEE_AD0
  Bottom 0.305: BEE.20 8.69,45.29 J8.10
BEE_AD1
  Bottom 0.305: BEE.19 12.37,46.99 9.53,46.99 J8.9
BEE_AD2
  Top 0.305: BEE.18 14.37,46.99 12.06,46.99 J8.8
BEE_AD3  (via drill 0.38 pad 0.81)
  Top 0.305: BEE.17 16.36,46.99 15.24,46.99 13.97,48.26 J8.7
  Top 0.406: C19.1 19.18,40.13 v19.68,40.64
  Bottom 0.152: WIRELESS_PROGRAMMING.2 WIRELESS_PROGRAMMING.1
  Bottom 0.406: WIRELESS_PROGRAMMING.1 18.03,45.26 BEE.17 | WIRELESS_PROGRAMMING.2 18.8,41.53 v19.68,40.64
BEE_AD4
  Top 0.305: BEE.11 28.57,46.78 J8.1
BEE_AD5
  Top 0.305: BEE.15 20.36,46.99 19.68,46.99 J8.5
BEE_AD6
  Top 0.305: BEE.16 18.36,46.99 17.27,46.99 16,48.26 J8.6
BEE_CD
  Top 0.305: BEE.4 16.36,21.59 15.24,21.59 13.97,20.32 J6.4
BEE_DTR
  Top 0.305: J6.9 26.04,21.26 BEE.9
BEE_EN  (via drill 0.38 pad 0.81)
  Top 0.203: U3.3 19.37,31.43 19.05,31.75 19.05,32.89 R2.2
  Top 0.406: v20.32,33.02 R2.2
  Bottom 0.406: POWER_BEE.1 v20.32,33.02
BEE_RESET
  Top 0.305: 6.99,46.99 6.99,49.53 7.62,50.16 13.97,50.16 14.61,50.8 BEE_RESET.P$2 | BEE.5 18.36,21.59 17.27,21.59 16,20.32 J6.5
  Top 0.406: J6.5 14.1,18.54 4.32,18.54 3.81,19.05 3.81,24.13 2.03,25.91 2.03,38.23 5.71,41.91 5.71,45.72 6.99,46.99
BEE_RSSI  (via drill 0.38 pad 0.81)
  Top 0.152: RSSI_STATUS.2 RSSI_STATUS.1
  Top 0.305: J6.6 18.92,20.32 21.89,23.29 BEE.6
  Top 0.406: R17.2 1.27,41.78 1.27,23.5 2.16,22.61 RSSI_STATUS.1 | RSSI_STATUS.2 v2.16,18.92
  Bottom 0.406: J6.6 16.64,18.54 2.54,18.54 v2.16,18.92
BEE_RXD
  Top 0.305: BEE.3 14.37,21.59 12.06,21.59 J6.3
  Top 0.406: BEE.3 16.07,24.45 R16.2
BEE_TXD
  Top 0.406: BEE.2 14.06,24.35 R15.2
  Bottom 0.305: BEE.2 12.37,21.59 9.53,21.59 J6.2
BEE_VREF
  Top 0.305: BEE.14 21.09,48.26 J8.4
BEES_RES0
  Top 0.305: J6.7 21.09,20.32 BEE.7
BEES_RES1
  Top 0.305: J6.8 23.5,20.72 BEE.8
C_VIN
  Top 0.152: CH_STATUS.1 CH_STATUS.2
  Top 0.406: D1.- 24.26,2.54 22.8,1.08 15.43,1.08 12.7,3.81 12.7,6.99 6.6,13.08 3.94,13.08 CH_STATUS.1 | R6.2 2.54,16 CH_STATUS.2
  Top 0.61: D1.- 24.77,2.54 26.04,1.27 32.38,1.27 33.02,1.91 33.02,2.54 | 33.02,2.54 33.02,3.17 | 33.02,3.17 33.02,3.81 | 33.02,3.81 U5.4 | 33.66,3.17 C9.+ 36.83,1.27 40.01,1.27 41.27,2.54 D2.- | 33.66,3.17 33.02,3.17 | 33.66,3.17 33.02,3.81 | 33.66,3.17 33.02,2.54
CH
  Top 0.406: CH.- 8.76,14.48 11.3,17.02 25.65,17.02 27.56,15.11 R18.2 28.83,14.48 30.48,12.83 U5.7
DTR
  Top 0.406: C1.2 89.03,36.07 91.44,33.66 91.44,27.94 87.63,24.13 J2.1
GND  (via drill 0.38 pad 0.81)
  Top 0.203: U6.2 45.47,10.29 45.09,10.67 43.81,10.67 43.69,10.79 v41.27,10.79
  Top 0.406: U1.21 34.18,38.97 C2.1 | R5.1 U5.3
  other vias: 73.41,39.37 74.55,39.37 67.31,41.27 67.31,40.01 57.78,41.91 59.05,40.64 60.33,39.37 66.04,48.26 64.77,48.26 63.5,48.26 57.15,36.2 54.61,36.2 52.07,36.2 49.28,40.01 38.73,39.37 40.64,39.37 42.55,39.37 45.09,44.45 45.09,46.99 48.9,46.99 48.9,44.45 52.7,44.45 52.7,46.99 32.26,13.97 35.56,13.34 36.83,13.34 41.91,15.88 43.18,15.88 43.18,17.14 40.01,10.79 28.57,3.17 27.3,3.17 27.3,4.45 34.92,4.57
  pour Top (rank 6): 13.34,63.5 12.06,63.5 12.06,62.23 13.34,62.23
  pour Top (rank 5, no thermals): 24.13,60.96 31.75,60.96 31.75,56.52 29.84,54.61 26.04,54.61 24.13,56.52
  pour Bottom (isolate 0.254, rank 6): 0,60.96 92.71,60.96 92.71,0 0,0
  pour Top (isolate 0.254, rank 6): 0,60.96 92.71,60.96 92.71,0 0,0
HEAT  (via drill 0.38 pad 0.81)
  other vias: 30.04,8.38 30.04,6.86 32.19,6.86 32.19,8.38 31.11,7.62
  pour Bottom (isolate 0.254): 28.57,9.53 33.66,9.53 33.66,5.71 28.57,5.71
  pour Top (isolate 0.254, no thermals): 29.21,9.14 33.02,9.14 33.02,6.1 29.21,6.1
HSCL
  Top 0.203: Q1.6 71.06,24.45 71.25,24.64 71.25,24.89 71.06,25.08 Q1.5 | 68.96,22.23 68.96,24.13 R21.1
  Top 0.406: Q1.5 69.91,25.08 R21.1 | 68.96,22.23 68.96,19.76 I2C.1
HSDA
  Top 0.203: Q1.7 71.06,23.81 71.25,23.62 71.25,23.37 71.06,23.18 Q1.8
  Top 0.406: Q1.8 69.91,23.18 R20.1 69.72,21.72 71.12,20.32 71.12,18.41 70.22,17.51 I2C.2
LI_BAT  (via drill 0.38 pad 0.81)
  Top 0.813: v29.21,12.7 C20.2 16.66,12.7 LIPO_BAT.1 | 33.02,11.68 v33.02,12.7 33.4,13.08 R14.1 R12.1 | 33.02,11.68 33.02,10.67 | 33.02,10.67 U5.5 | v29.21,12.7 28.57,12.7 29.21,12.06 v29.21,12.7 | v29.21,12.7 U5.8 | 33.53,11.18 Q3.3 | 33.02,11.68 33.53,11.18 | 33.02,10.67 33.53,11.18 | D4.+ v36.83,4.45
  Bottom 0.813: v29.21,12.7 v33.02,12.7 34.29,12.7 36.83,10.16 v36.83,4.45
N$1
  Top 0.406: R10.2 PB0.+
N$3
  Top 0.813: D1.+ 20.05,4.71 SOLAR.1
N$5
  Top 0.813: U5.2 30.48,3.43 R5.2
N$6
  Top 0.254: R17.1 RSSI.+
N$8
  Top 0.406: R6.1 CH.+ OK.+
OK
  Top 0.203: 27.94,15.88 29.59,15.88 R19.2
  Top 0.406: OK.- 9.02,16 10.79,17.78 26.04,17.78 27.94,15.88 | U5.6 31.75,13.08 30.35,14.48 R19.2
ON/!SLEEP
  Top 0.305: BEE.13 23.5,47.86 J8.3
PB0  (via drill 0.38 pad 0.81)
  Top 0.406: PB.1 50.16,50.42 42.55,50.42 40.41,48.28 U1.12 40.41,41.93 v40.39,41.91 | R8.1 v76.83,26.04
  Bottom 0.406: v40.39,41.91 41.66,40.64 42.55,40.64 43.05,41.15 55.37,41.15 69.47,27.05 75.82,27.05 v76.83,26.04
PB1/CS2
  Top 0.406: U1.13 39.6,48.49 42.23,51.12 48.32,51.12 PB.2
  Bottom 0.406: CS_TF.00 60.07,46.35 PB.2
PB2/CS1  (via drill 0.38 pad 0.81)
  Top 0.406: U1.14 38.8,48.71 41.91,51.82 46.48,51.82 PB.3 | TF1.2 63.7,45.28 v63.5,45.09
  Bottom 0.152: CS_TF.11 CS_TF.MM
  Bottom 0.406: CS_TF.MM v63.5,45.09 | PB.3 50.55,53.34 51.82,53.34 61.34,43.81 CS_TF.11
PB3/MOSI  (via drill 0.38 pad 0.81)
  Top 0.406: U1.15 38.01,48.93 41.59,52.51 44.64,52.51 PB.4 | TF1.3 59.71,44.18 v59.56,44.32
  Bottom 0.406: PB.4 48.77,52.58 51.31,52.58 v59.56,44.32 67.06,36.83 76.2,36.83 77.47,35.56 77.47,33.02 ICSP.5
PB4/MISO  (via drill 0.38 pad 0.81)
  Top 0.406: U1.16 37.2,49.14 41.27,53.21 42.8,53.21 PB.5 | TF1.7 62.84,39.78 v62.74,39.88
  Bottom 0.406: PB.5 46.99,51.82 50.8,51.82 v62.74,39.88 68.33,34.29 ICSP.1
PB5/SCK  (via drill 0.3 pad 0.64, 0.38 pad 0.81)
  Top 0.406: PB.6 36.39,49.34 36.39,42.55 36.01,42.17 U1.17 34.66,42.17 34.29,42.55 v34.29,43.18 | TF1.5 59.37,41.98 v59.31,42.04 | v34.29,45.72 R10.1
  Bottom 0.152: D13_LED.1 D13_LED.2
  Bottom 0.406: PB.6 45.21,51.05 50.29,51.05 v59.31,42.04 69.6,31.75 ICSP.2 | D13_LED.2 v34.29,45.72 | D13_LED.1 v34.29,43.18
PC0
  Top 0.406: U1.23 34.83,37.37 34.48,37.02 34.48,32.58 39.37,27.69 45.97,27.69 63.5,10.16 PC.1
PC1
  Top 0.406: U1.24 35.36,36.57 35.24,36.45 35.24,32.96 39.75,28.45 46.48,28.45 66.04,8.89 PC.2
PC2
  Top 0.406: U1.25 37.2,32.14 40.13,29.21 46.99,29.21 68.58,7.62 PC.3
PC3
  Top 0.406: U1.26 38.01,32.48 40.51,29.97 47.5,29.97 PC.4
PC4/SDA  (via drill 0.38 pad 0.81)
  Top 0.203: 74.55,26.67 74.55,24.13 R9.1
  Top 0.406: U1.27 38.8,32.82 40.89,30.73 48.01,30.73 70.48,8.26 71.75,8.26 PC.5 | U7.15 75.69,41.91 76.2,41.4 76.2,36.96 74.55,35.31 74.55,26.67 | Q1.1 73.6,23.18 R9.1 73.79,22.23 v73.66,22.1
  Bottom 0.406: PC.5 v73.66,22.1
PC5/SCL  (via drill 0.38 pad 0.81)
  Top 0.406: U1.28 39.6,33.17 41.27,31.5 48.51,31.5 70.99,9.02 73.53,9.02 PC.6 | U7.16 74.93,40.64 75.44,40.13 75.44,37.21 73.79,35.56 v73.79,26.04 R1.1 73.34,24.45 Q1.3
  Bottom 0.406: PC.6 76.2,23.62 v73.79,26.04
PD0/RXD  (via drill 0.38 pad 0.81)
  Top 0.406: v41.27,36.83 41.2,36.76 U1.30 41.2,33.85 42.04,33.02 69.22,33.02 70.99,34.8 70.99,47.37 71.75,48.13 71.75,50.16 PD.1 | R15.1 28.57,27.94 v30.48,29.84
  Bottom 0.406: PD.1 82.55,48.26 82.55,27.94 85.22,25.27 85.22,20.45 J2.3 | v30.48,29.84 34.29,29.84 v41.27,36.83
PD1/TXD  (via drill 0.38 pad 0.81)
  Top 0.406: v42.67,36.83 42.01,36.16 U1.31 42.01,34.2 42.42,33.78 68.96,33.78 70.23,35.05 70.23,47.62 70.99,48.39 70.99,51.94 PD.2 | R16.1 27.94,26.04 v30.48,28.57
  Bottom 0.406: PD.2 74.93,53.34 76.33,53.34 81.79,47.88 81.79,23.62 J2.2 | v30.48,28.57 34.42,28.57 v42.67,36.83
PD2
  Top 0.406: PD.3 70.23,53.72 70.23,48.64 69.47,47.88 69.47,35.31 68.71,34.54 43.05,34.54 42.8,34.79 U1.32
  Bottom 0.406: !INT.2 77.47,48.26 PD.3
PD3
  Top 0.406: U1.1 44.71,36.57 45.97,35.31 49.28,35.31 51.56,37.59 66.8,37.59 68.71,39.5 68.71,48.13 69.47,48.9 69.47,53.72 PD.4
  Bottom 0.406: RST/32K.MM 68.58,45.09 67.94,45.72 67.94,53.98 PD.4
PD4  (via drill 0.38 pad 0.81)
  Top 0.406: U1.2 48.16,37.37 v48.9,38.1 53.98,43.18 53.98,48.39 57.4,51.82 63.25,51.82 PD.5
  Bottom 0.406: v48.9,38.1 47.94,37.15 47.94,14.29 48.9,13.34 POWER_TF.2
PD5  (via drill 0.38 pad 0.81)
  Top 0.406: U1.9 42.8,47.63 43.5,48.32 52.9,48.32 57.15,52.58 61.47,52.58 PD.6 60.2,57.91 35.18,57.91 31.37,54.1 31.37,37.08 v27.3,33.02
  Bottom 0.406: v27.3,33.02 POWER_BEE.2
PD6
  Top 0.406: U1.10 42.01,47.85 43.18,49.02 52.58,49.02 56.9,53.34 59.69,53.34 PD.7
PD7  (via drill 0.38 pad 0.81)
  Top 0.406: PD.8 57.15,54.61 52.26,49.72 42.86,49.72 41.2,48.06 U1.11 41.2,42.62 v41.91,41.91 | R4.1 v78.74,26.04
  Bottom 0.406: v78.74,26.04 76.96,27.81 69.98,27.81 55.88,41.91 v41.91,41.91
RTC!RST  (via drill 0.38 pad 0.81)
  Top 0.406: U7.4 82.55,44.45 80.01,46.99 v76.45,46.99
  Bottom 0.406: v76.45,46.99 70.48,46.99 RST/32K.00
RVIN  (via drill 0.38 pad 0.81)
  Top 0.203: U3.1 18.73,29.53 18.41,29.84 18.41,32.26 R2.1
  Top 0.406: R21.2 R20.2 67.18,22.35 67.18,17.27 68.94,15.51 I2C.3
  Top 0.61: Q3.2 C18.+ 38.45,9.49 U2.1 39.69,8.57 40.01,8.26 41.27,8.26 | 41.59,8.57 U2.3 42.52,9.49 R3.1 43.98,10.03 U6.1 44.52,8.57 44.83,8.26 50.16,8.26 v55.88,13.97 | 41.59,8.57 41.27,8.26 | I2C.3 D7,8.3 | 41.59,8.57 41.59,6.41 D3.- | 41.27,8.26 41.53,8
  Top 0.813: C18.+ v38.1,10.16 | U3.1 22.16,29.53 C16.+ 22.35,29.59 22.73,29.21 v24.13,29.21
  Bottom 0.61: v55.88,13.97 57.42,15.51 I2C.3
  Bottom 0.813: v38.1,10.16 38.1,18.41 27.3,29.21 v24.13,29.21
RX
  Top 0.406: D7,8.1 R4.2
TF_3V3  (via drill 0.38 pad 0.81)
  Top 0.61: C10.1 67.28,43.08 TF1.4 56.54,43.08 C8.1 52.83,40.51 v48.9,36.58 | U6.5 44.52,13.78 C21.1 44.58,18.54 v48.9,22.86
  Bottom 0.61: v48.9,22.86 v48.9,36.58 49.78,37.47 TF3V3.T
TF_EN  (via drill 0.38 pad 0.81)
  Top 0.203: U6.3 46.42,10.35 45.72,11.05 44.07,11.05 43.56,11.56 R3.2
  Top 0.406: U6.3 48.87,9.49 v48.9,9.53
  Bottom 0.406: v48.9,9.53 POWER_TF.1
TIMEKEEPING  (via drill 0.3 pad 0.64)
  Top 0.406: BAT.T BAT1.+ 63.5,28.57 65.91,30.99 68.2,30.99 71.75,34.54 71.75,37.47 72.14,37.85 C4.2 71.75,38.48 71.75,42.55 72.39,43.18 U7.14
  other vias: 60.33,25.4
TX
  Top 0.406: R8.2 76.83,18.54 77.87,17.51 D7,8.2
USB5V
  Top 0.406: R7.2 34.92,8.76 34.92,8.89 Q3.1
  Top 0.61: 41.27,4.45 D3.+ 37.34,6.35 R7.2 | D2.+ 39.37,2.67 41.15,4.45 41.27,4.45 | D4.- 41.27,4.45
  Top 0.813: ICSP.6 81.28,31.75 81.28,19.05 J2.4 81.28,13.97 81.28,7.62 77.47,3.81 51.44,3.81 | 51.44,3.81 50.8,3.81 | 50.8,3.81 50.16,3.81 | 50.16,3.81 42.55,3.81 41.91,4.45 41.27,4.45 | PWR.4 50.8,4.45 | 50.8,4.45 50.8,3.81 | 50.8,4.45 51.44,3.81 | 50.8,4.45 50.16,3.81
V_REF
  Top 0.406: U1.20 34.91,39.77 C2.2 32.38,42.29 32.38,51.69 35.31,54.61 PB.8
XTAL1
  Top 0.406: U1.7 50.01,41.37 C6.2 51.18,45.78 X3.2
XTAL2
  Top 0.406: U1.8 46.23,42.17 C7.2 46.61,45.78 X3.1

### Text on the board
tPlace: PWM | PWM | PWM | PWM | PWM | PWM | TXD | RXD | AREF | GND | 13 | 12 | 11 | 10 | 9 | 8 | 7 | 6 | 5 | 4 | 3 | 2 | 1 | 0 | 1 | DTR | TXD | SCL | D7 | RXD | SDA | D8 | USB5V | VCC | VCC | - | GND | GND | GND | + | GND | - | + | NC | A0 | A1 | A2 | A3 | SDA | SCL | 3V3 | GND | GND | ANALOG IN | RESET | USB5V
bPlace: D9 | RTC_!RST | SS | PD3 | PD2 | !INT | D10 | 32KHz | Seeeduino Stalker | V2.3 by Seeed Studio | 12/29/2011 | EN | PD5 | www.seeedstudio.com | PD4 | EN